# Altium schematic sheet ShoulderDriver.SchDoc
size Letter
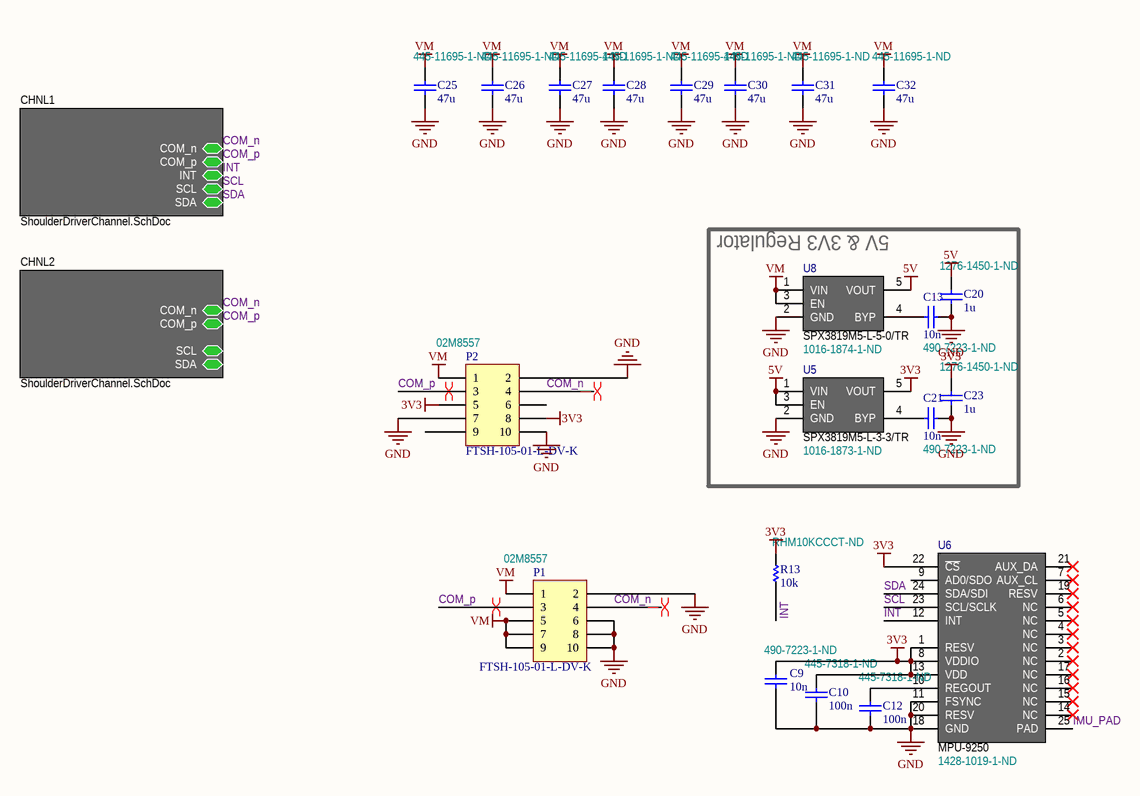
[diagram p0: ShoulderDriver.SchDoc]

## Parts
C9  10n  Supplier Part Number 1: 490-7223-1-ND  [CAPC0603N]
C10  100n  Supplier Part Number 1: 445-7318-1-ND  [CAPC0603N]
C12  100n  Supplier Part Number 1: 445-7318-1-ND  [CAPC0603N]
C13  10n  Supplier Part Number 1: 490-7223-1-ND  [CAPC0603N]
C20  1u  Supplier Part Number 1: 1276-1450-1-ND  [CAPC1005N]
C21  10n  Supplier Part Number 1: 490-7223-1-ND  [CAPC0603N]
C23  1u  Supplier Part Number 1: 1276-1450-1-ND  [CAPC1005N]
C25  47u  Supplier Part Number 1: 445-11695-1-ND  [CAPC3216N]
C26  47u  Supplier Part Number 1: 445-11695-1-ND  [CAPC3216N]
C27  47u  Supplier Part Number 1: 445-11695-1-ND  [CAPC3216N]
C28  47u  Supplier Part Number 1: 445-11695-1-ND  [CAPC3216N]
C29  47u  Supplier Part Number 1: 445-11695-1-ND  [CAPC3216N]
C30  47u  Supplier Part Number 1: 445-11695-1-ND  [CAPC3216N]
C31  47u  Supplier Part Number 1: 445-11695-1-ND  [CAPC3216N]
C32  47u  Supplier Part Number 1: 445-11695-1-ND  [CAPC3216N]
P1  FTSH-105-01-L-DV-K  Supplier Part Number 1: 02M8557  [FTSH-105-01-L-DV-K]
P2  FTSH-105-01-L-DV-K  Supplier Part Number 1: 02M8557  [FTSH-105-01-L-DV-K]
R13  10k  Supplier Part Number 1: RHM10KCCCT-ND  [RESC0603N]
U5  SPX3819M5-L-3-3/TR  Supplier Part Number 1: 1016-1873-1-ND  [SOT23-5AN]
U6  MPU-9250  Supplier Part Number 1: 1428-1019-1-ND  [QFN40P300X300X105_HS-25N]
U8  SPX3819M5-L-5-0/TR  Supplier Part Number 1: 1016-1874-1-ND  [SOT23-5AN]

## Blocks framed on the sheet
5V & 3V3 Regulator: C13 C20 C21 C23 U5 U8

## Sub-sheets
CHNL1 = ShoulderDriverChannel.SchDoc: COM_p (bidir), COM_n (bidir), SCL (bidir), SDA (bidir), INT (bidir)
CHNL2 = ShoulderDriverChannel.SchDoc: COM_n (bidir), COM_p (bidir), SCL (bidir), SDA (bidir)

## Nets
3V3: C9.2 C10.2 C23.2 P2.5 P2.8 R13.2 U5.5(VOUT) U6.1(RESV) U6.8(VDDIO) U6.13(VDD) U6.22(~{CS})
5V: C20.2 U5.1(VIN) U5.3(EN) U8.5(VOUT)
GND: C9.1 C10.1 C12.1 C13.1 C20.1 C21.1 C23.1 C25.1 C26.1 C27.1 C28.1 C29.1 C30.1 C31.1 C32.1 P1.2 P1.6 P1.8 P1.10 P2.2 P2.7 P2.10 U5.2(GND) U6.11(FSYNC) U6.18(GND) U6.20(RESV) U8.2(GND)
VM: C25.2 C26.2 C27.2 C28.2 C29.2 C30.2 C31.2 C32.2 P1.1 P1.5 P1.7 P1.9 P2.1 U8.1(VIN) U8.3(EN)
COM_n: P1.4 P2.4 ; sheet CHNL1/COM_n, sheet CHNL2/COM_n
COM_p: P1.3 P2.3 ; sheet CHNL1/COM_p, sheet CHNL2/COM_p
IMU_PAD: U6.25(PAD)
INT: R13.1 U6.12(INT) ; sheet CHNL1/INT
SCL: U6.23(SCL/SCLK) ; sheet CHNL1/SCL
SDA: U6.24(SDA/SDI) ; sheet CHNL1/SDA
NetC12_2: C12.2 U6.10(REGOUT)
NetC13_2: C13.2 U8.4(BYP)
NetC21_2: C21.2 U5.4(BYP)

Not connected (* = marked no-connect by the designer): P2 6 9; U6 2(NC)* 3(NC)* 4(NC)* 5(NC)* 6(NC)* 7(AUX_CL)* 9(AD0/SDO) 14(NC)* 15(NC)* 16(NC)* 17(NC)* 19(RESV)* 21(AUX_DA)*

## Layout directives
differential pair: COM_n, COM_p

## Library data of the parts
C9 C10 C12 C13 C20 C21 C23 C25-C32 = Cap Semi: Capacitor (Semiconductor SIM Model); Published: 8-Jun-2000; LatestRevisionDate: 29-May-2009; LatestRevisionNote: IPC-7351 Footprint Added.; PackageReference: C1206; Publisher: Altium Limited; PackageDescription: Chip Capacitor; Supplier 1: Digi-Key
P1 P2 = MHDR2X5: Header, 5-Pin, Dual row; LatestRevisionDate: 17-Jul-2002; LatestRevisionNote: Re-released for DXP Platform.; Publisher: Altium Limited; Supplier 1: Newark
R13 = Res Semi: Semiconductor Resistor; Published: 8-Jun-2000; LatestRevisionDate: 17-Jul-2002; LatestRevisionNote: Re-released for DXP Platform.; PackageReference: AXIAL-0.5; Publisher: Altium Limited; PackageDescription: Axial Device, Thru-Hole; 2 Leads; 0.5 in Pin Spacing; Supplier 1: Digi-Key
U5 = SPX3819M5-L-3-3/TR: IC REG LDO 3.3V 0.5A SOT23-5; Manufacturer: Exar Corporation; Regulator Topology: Positive Fixed; Current - Output: 500mA; Voltage - Dropout (Typical): 0.34V @ 500mA; Number of Regulators: 1; Voltage - Input: Up to 16V; Supplier 1: Digi-Key; Manufacturer Part Number: SPX3819M5-L-3-3/TR; RoHS: RoHS Compliant; Category: Integrated Circuits (ICs); Stock 1: 6113; Pricing 1: 1=0.78, 10=0.682, 25=0.6028, 100=0.5254, 250=0.4574, 500=0.38934 (USD); Packaging: Cut Tape (CT); Voltage - Output: 3.3V; Current - Limit (Min): -; Operating Temperature: -40°C ~ 125°C; Mounting Type: Surface Mount; Package / Case: SC-74A, SOT-753; Supplier Device Package: SOT-23-5; ComponentLink1URL: http://www.exar.com/Common/Content/Document.ashx?id=615; ComponentLink1Description: http://www.exar.com/Common/Content/Document.ashx?id=615
U6 = MPU-9250: GYRO/ACCEL/COMPASS/9-AXIS; Manufacturer: InvenSense; Sensor Type: Accelerometer, Gyroscope, Magnetometer; Output Type: I²C, SPI; Supplier 1: Digi-Key; Manufacturer Part Number: MPU-9250; RoHS: RoHS Compliant; Category: Sensors, Transducers; Stock 1: 2579; Pricing 1: 1=12.7, 5=11.138, 10=10.024, 25=8.91, 50=8.2418, 100=7.128, 250=6.90524, 500=6.6825, 750=6.45975 (USD); ComponentLink1URL: http://www.invensense.com/mems/gyro/documents/PS-MPU-9250A-01.pdf; ComponentLink1Description: http://www.invensense.com/mems/gyro/documents/PS-MPU-9250A-01.pdf
U8 = SPX3819M5-L-5-0/TR: IC REG LDO 5V 0.5A SOT23-5; Manufacturer: Exar Corporation; Regulator Topology: Positive Fixed; Current - Output: 500mA; Voltage - Dropout (Typical): 0.34V @ 500mA; Number of Regulators: 1; Voltage - Input: Up to 16V; Supplier 1: Digi-Key; Manufacturer Part Number: SPX3819M5-L-5-0/TR; RoHS: RoHS Compliant; Category: Integrated Circuits (ICs); Stock 1: 5326; Pricing 1: 1=0.78, 10=0.682, 25=0.6028, 100=0.5254, 250=0.4574, 500=0.38934 (USD); Packaging: Cut Tape (CT); Voltage - Output: 5V; Current - Limit (Min): -; Operating Temperature: -40°C ~ 125°C; Mounting Type: Surface Mount; Package / Case: SC-74A, SOT-753; Supplier Device Package: SOT-23-5; ComponentLink1URL: http://www.exar.com/Common/Content/Document.ashx?id=615; ComponentLink1Description: http://www.exar.com/Common/Content/Document.ashx?id=615